# Altium schematic sheet AUAV_X05_ESC.SchDoc
size A1
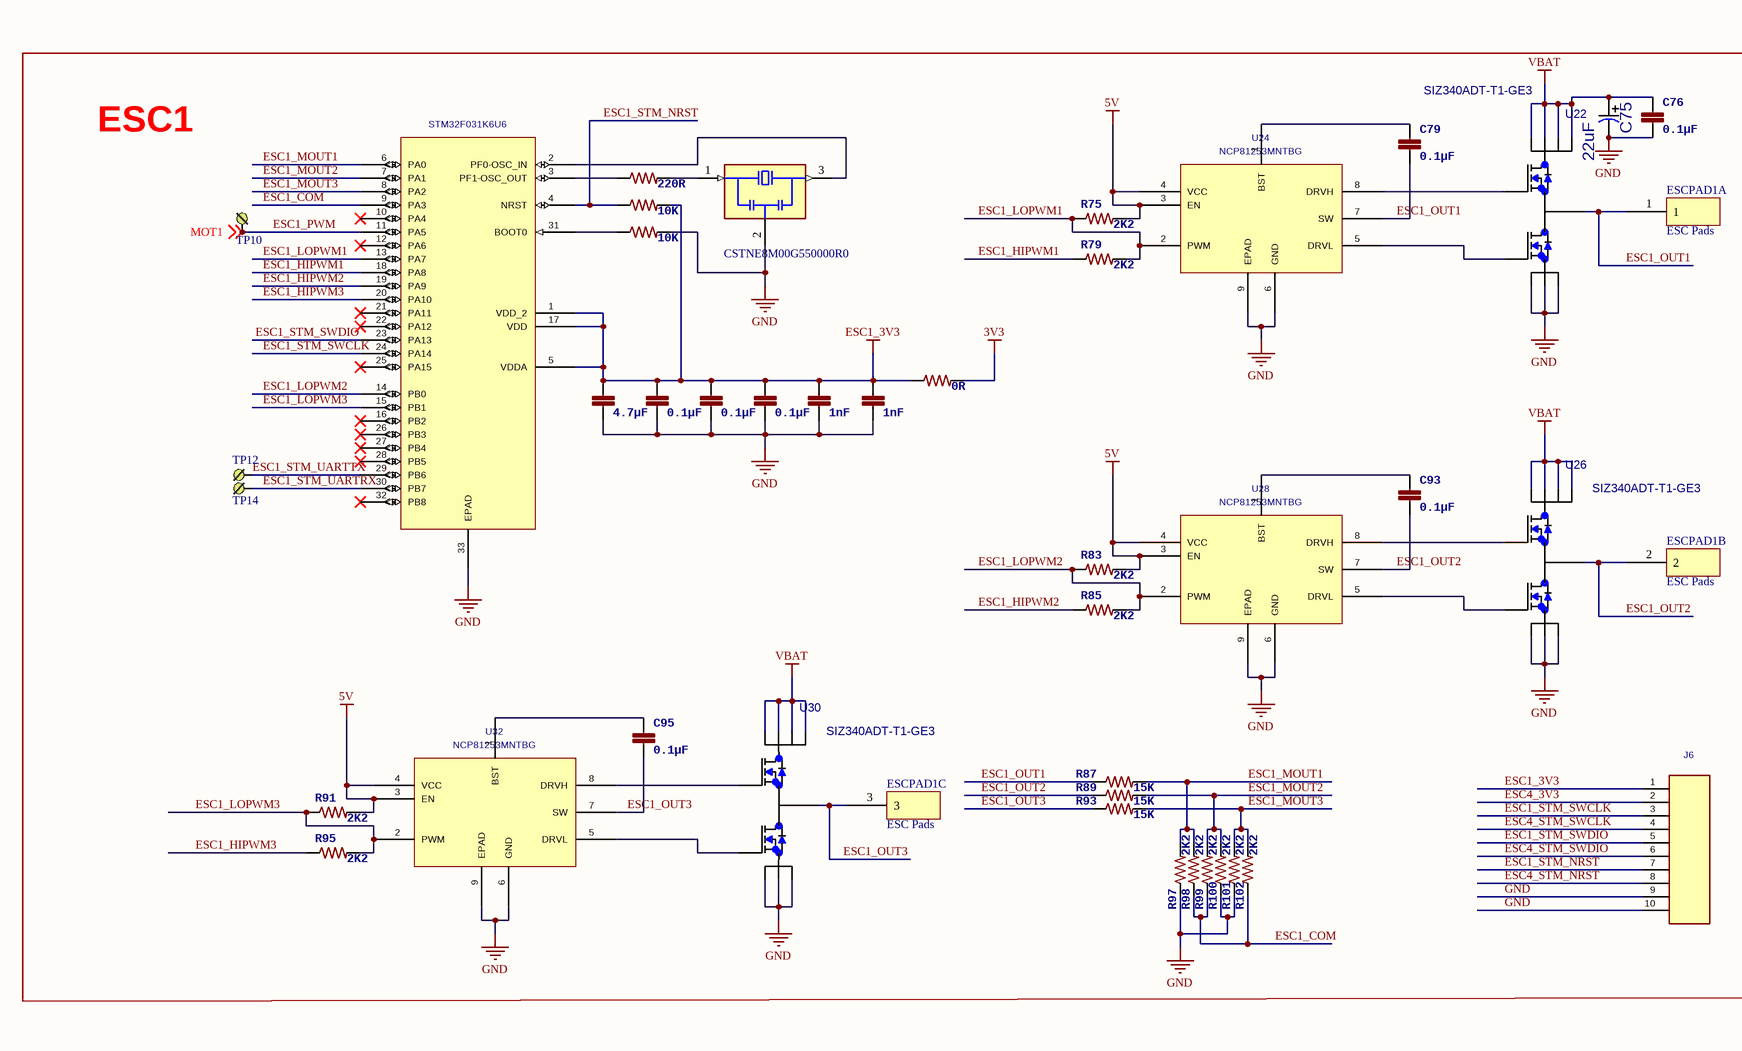
[diagram p0: AUAV_X05_ESC.SchDoc, top left]
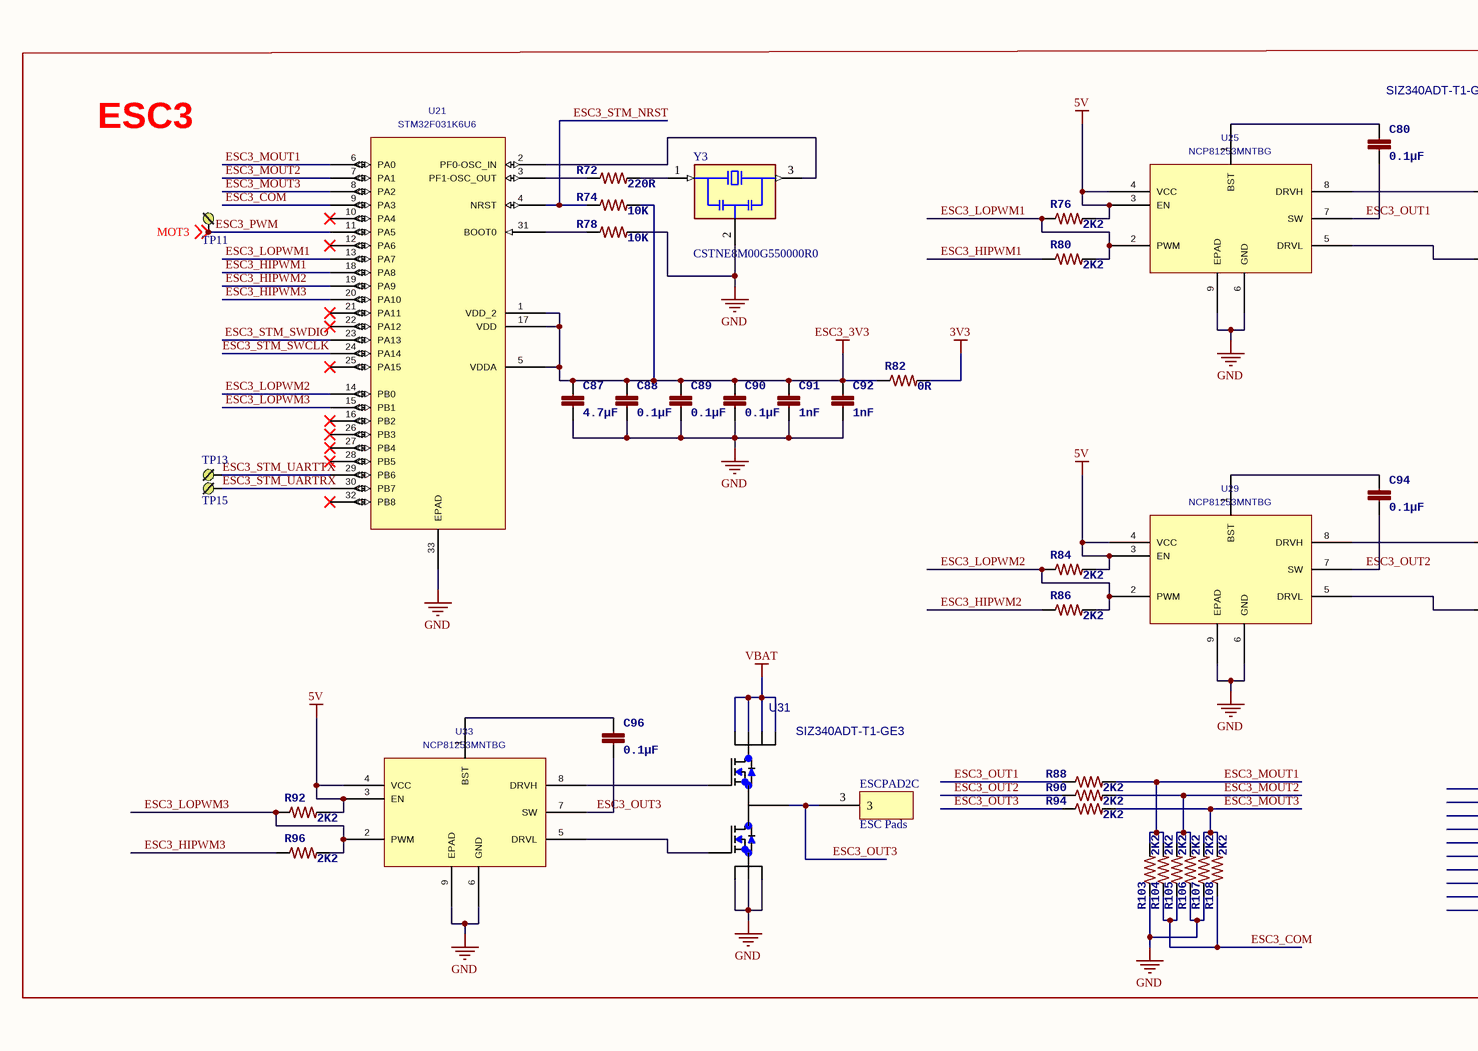
[diagram p1: AUAV_X05_ESC.SchDoc, top middle]
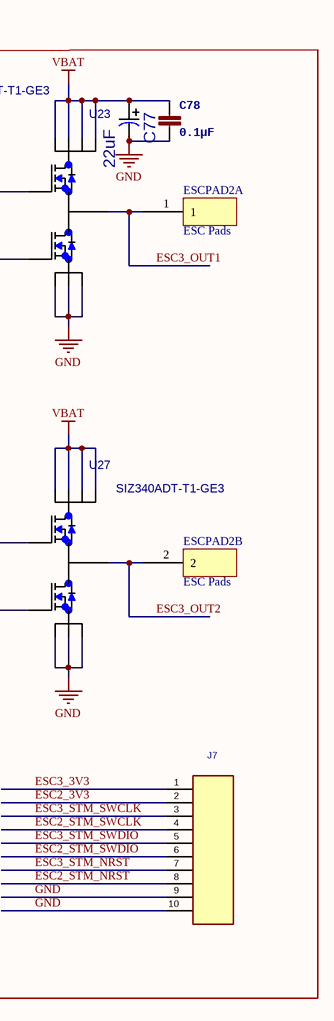
[diagram p2: AUAV_X05_ESC.SchDoc, top right]
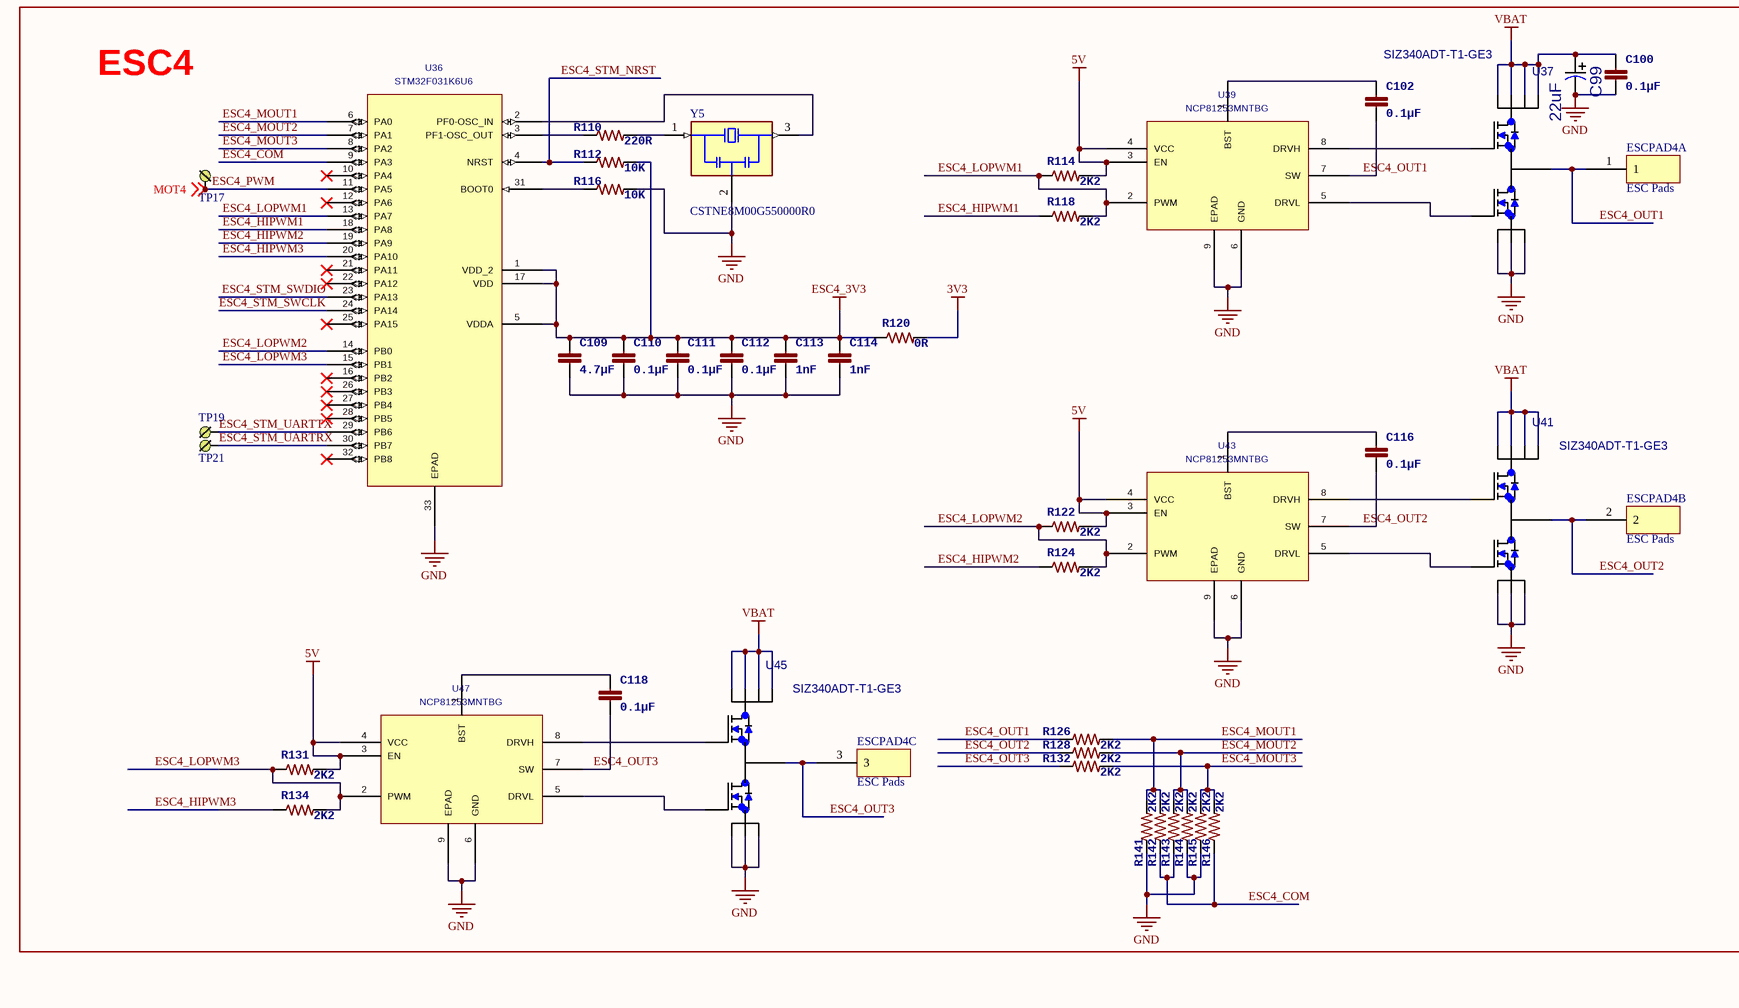
[diagram p3: AUAV_X05_ESC.SchDoc, bottom left]
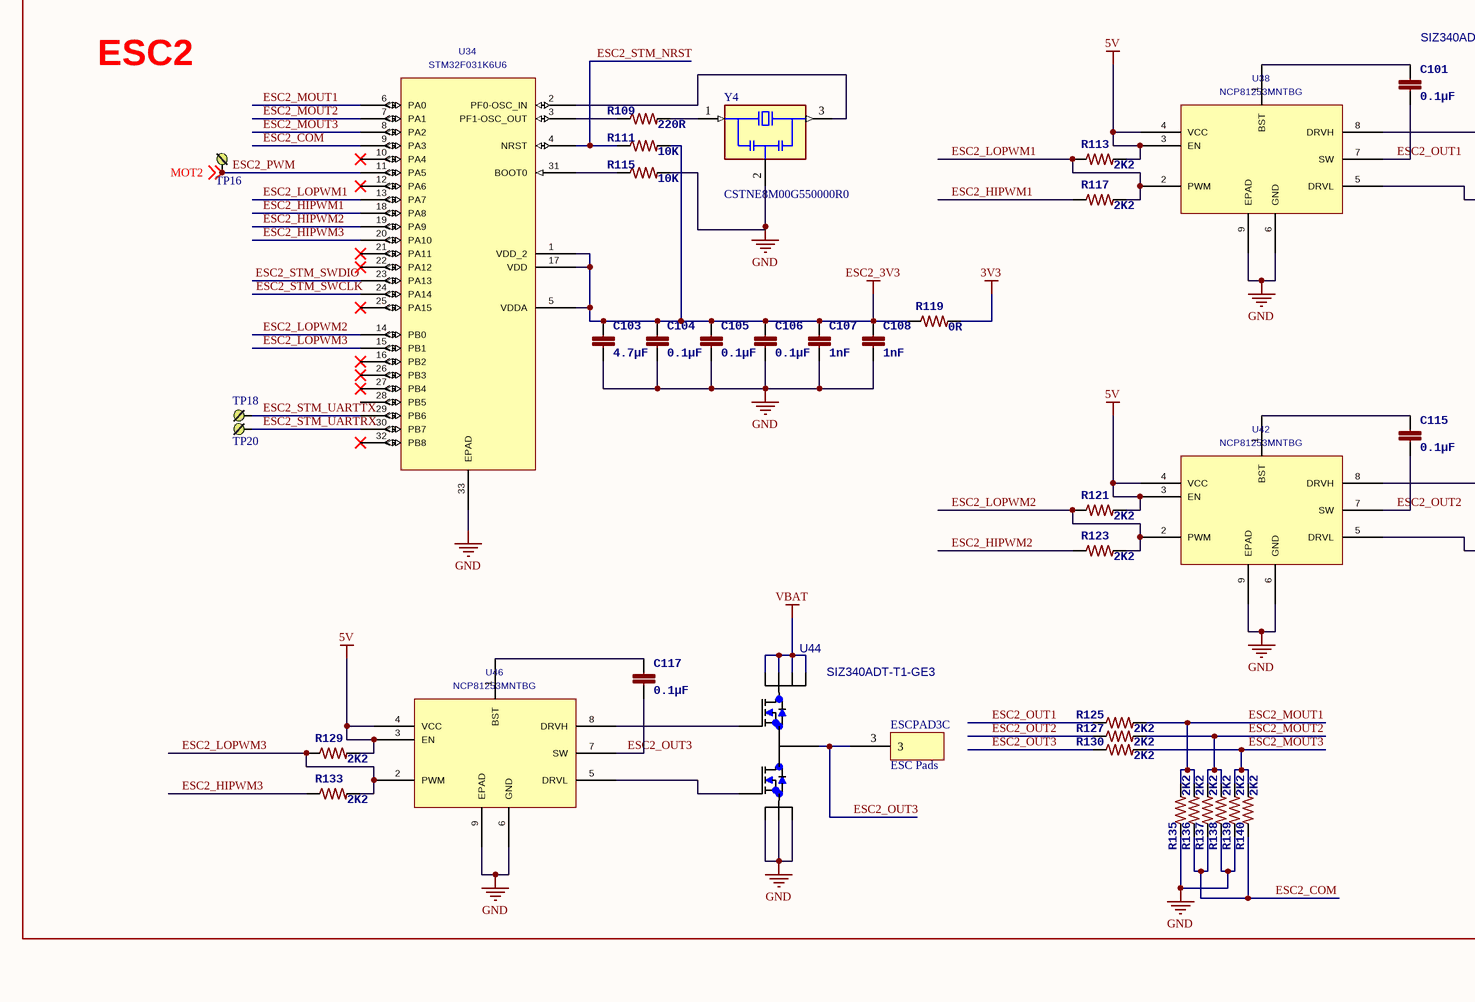
[diagram p4: AUAV_X05_ESC.SchDoc, bottom middle]
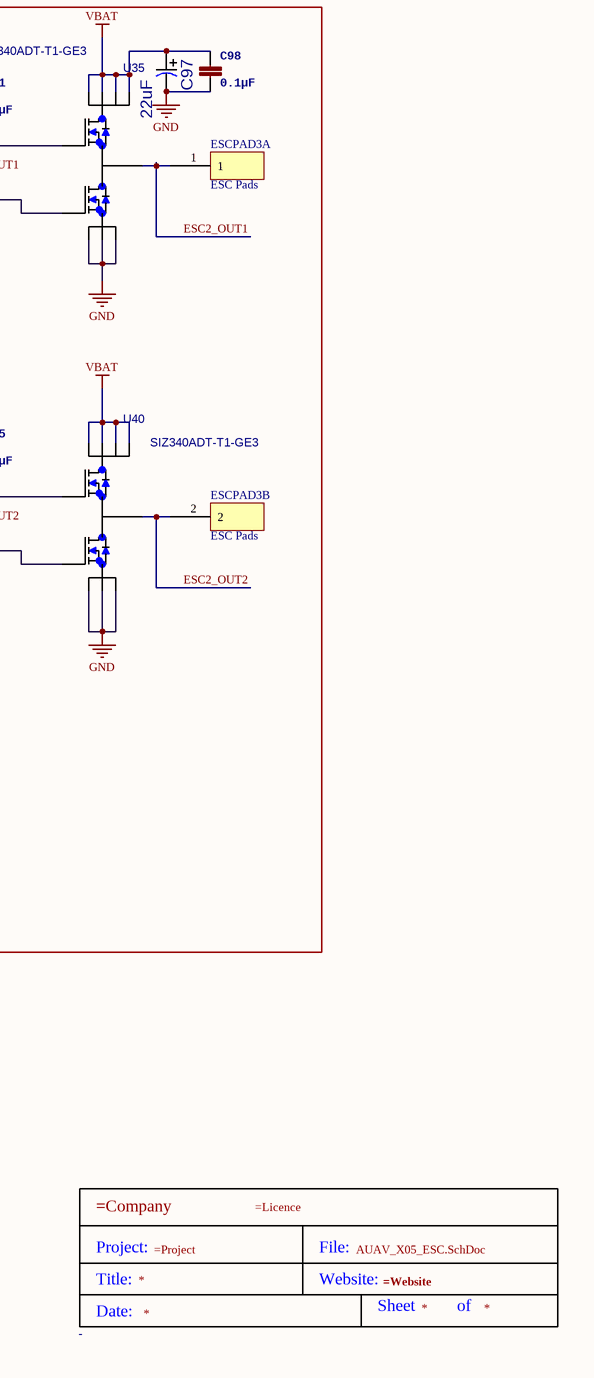
[diagram p5: AUAV_X05_ESC.SchDoc, bottom right]

## Parts
*?  Title Block  (value not drawn)
C75  value 22uF  [CAPMP3.4X1.6_1.8]  (hidden comment: CAP TANT 1206)
C76  0.1µF  [0402-CAP]
C77  value 22uF  [CAPMP3.4X1.6_1.8]  (hidden comment: CAP TANT 1206)
C78  0.1µF  [0402-CAP]
C79  0.1µF  [0402-CAP]
C80  0.1µF  [0402-CAP]
C81  4.7µF  [0603-CAP]
C82  0.1µF  [0402-CAP]
C83  0.1µF  [0402-CAP]
C84  0.1µF  [0402-CAP]
C85  1nF  [0402-CAP]
C86  1nF  [0402-CAP]
C87  4.7µF  [0603-CAP]
C88  0.1µF  [0402-CAP]
C89  0.1µF  [0402-CAP]
C90  0.1µF  [0402-CAP]
C91  1nF  [0402-CAP]
C92  1nF  [0402-CAP]
C93  0.1µF  [0402-CAP]
C94  0.1µF  [0402-CAP]
C95  0.1µF  [0402-CAP]
C96  0.1µF  [0402-CAP]
C97  value 22uF  [CAPMP3.4X1.6_1.8]  (hidden comment: CAP TANT 1206)
C98  0.1µF  [0402-CAP]
C99  value 22uF  [CAPMP3.4X1.6_1.8]  (hidden comment: CAP TANT 1206)
C100  0.1µF  [0402-CAP]
C101  0.1µF  [0402-CAP]
C102  0.1µF  [0402-CAP]
C103  4.7µF  [0603-CAP]
C104  0.1µF  [0402-CAP]
C105  0.1µF  [0402-CAP]
C106  0.1µF  [0402-CAP]
C107  1nF  [0402-CAP]
C108  1nF  [0402-CAP]
C109  4.7µF  [0603-CAP]
C110  0.1µF  [0402-CAP]
C111  0.1µF  [0402-CAP]
C112  0.1µF  [0402-CAP]
C113  1nF  [0402-CAP]
C114  1nF  [0402-CAP]
C115  0.1µF  [0402-CAP]
C116  0.1µF  [0402-CAP]
C117  0.1µF  [0402-CAP]
C118  0.1µF  [0402-CAP]
ESCPAD1  ESC Pads  [ESCPADS]  (parts A,B,C of 3)
ESCPAD2  ESC Pads  [ESCPADS]  (parts A,B,C of 3)
ESCPAD3  ESC Pads  [ESCPADS]  (parts A,B,C of 3)
ESCPAD4  ESC Pads  [ESCPADS]  (parts A,B,C of 3)
J6  20021121-00010C4  [CONN_00010C4LF_A]  (value not drawn)
J7  20021121-00010C4  [CONN_00010C4LF_A]  (value not drawn)
R71  220R  [0402-RES]
R72  220R  [0402-RES]
R73  10K  [0402-RES]
R74  10K  [0402-RES]
R75  2K2  [0402-RES]
R76  2K2  [0402-RES]
R77  10K  [0402-RES]
R78  10K  [0402-RES]
R79  2K2  [0402-RES]
R80  2K2  [0402-RES]
R81  0R  [0402-RES]
R82  0R  [0402-RES]
R83  2K2  [0402-RES]
R84  2K2  [0402-RES]
R85  2K2  [0402-RES]
R86  2K2  [0402-RES]
R87  15K  [0402-RES]
R88  2K2  [0402-RES]
R89  15K  [0402-RES]
R90  2K2  [0402-RES]
R91  2K2  [0402-RES]
R92  2K2  [0402-RES]
R93  15K  [0402-RES]
R94  2K2  [0402-RES]
R95  2K2  [0402-RES]
R96  2K2  [0402-RES]
R97  2K2  [0402-RES]
R98  2K2  [0402-RES]
R99  2K2  [0402-RES]
R100  2K2  [0402-RES]
R101  2K2  [0402-RES]
R102  2K2  [0402-RES]
R103  2K2  [0402-RES]
R104  2K2  [0402-RES]
R105  2K2  [0402-RES]
R106  2K2  [0402-RES]
R107  2K2  [0402-RES]
R108  2K2  [0402-RES]
R109  220R  [0402-RES]
R110  220R  [0402-RES]
R111  10K  [0402-RES]
R112  10K  [0402-RES]
R113  2K2  [0402-RES]
R114  2K2  [0402-RES]
R115  10K  [0402-RES]
R116  10K  [0402-RES]
R117  2K2  [0402-RES]
R118  2K2  [0402-RES]
R119  0R  [0402-RES]
R120  0R  [0402-RES]
R121  2K2  [0402-RES]
R122  2K2  [0402-RES]
R123  2K2  [0402-RES]
R124  2K2  [0402-RES]
R125  2K2  [0402-RES]
R126  2K2  [0402-RES]
R127  2K2  [0402-RES]
R128  2K2  [0402-RES]
R129  2K2  [0402-RES]
R130  2K2  [0402-RES]
R131  2K2  [0402-RES]
R132  2K2  [0402-RES]
R133  2K2  [0402-RES]
R134  2K2  [0402-RES]
R135  2K2  [0402-RES]
R136  2K2  [0402-RES]
R137  2K2  [0402-RES]
R138  2K2  [0402-RES]
R139  2K2  [0402-RES]
R140  2K2  [0402-RES]
R141  2K2  [0402-RES]
R142  2K2  [0402-RES]
R143  2K2  [0402-RES]
R144  2K2  [0402-RES]
R145  2K2  [0402-RES]
R146  2K2  [0402-RES]
TP10  TP  [SMT_PAD]  (value not drawn)
TP11  TP  [SMT_PAD]  (value not drawn)
TP12  TP  [SMT_PAD]  (value not drawn)
TP13  TP  [SMT_PAD]  (value not drawn)
TP14  TP  [SMT_PAD]  (value not drawn)
TP15  TP  [SMT_PAD]  (value not drawn)
TP16  TP  [SMT_PAD]  (value not drawn)
TP17  TP  [SMT_PAD]  (value not drawn)
TP18  TP  [SMT_PAD]  (value not drawn)
TP19  TP  [SMT_PAD]  (value not drawn)
TP20  TP  [SMT_PAD]  (value not drawn)
TP21  TP  [SMT_PAD]  (value not drawn)
U20  STM32F031K6U6  [UFQFPN32-5X5MM]
U21  STM32F031K6U6  [UFQFPN32-5X5MM]
U22  SIZ340ADT-T1-GE3  [MOSFET_DT-T1-GE3]
U23  SIZ340ADT-T1-GE3  [MOSFET_DT-T1-GE3]
U24  NCP81253MNTBG  [DFN8_2X2_ONS-L]
U25  NCP81253MNTBG  [DFN8_2X2_ONS-L]
U26  SIZ340ADT-T1-GE3  [MOSFET_DT-T1-GE3]
U27  SIZ340ADT-T1-GE3  [MOSFET_DT-T1-GE3]
U28  NCP81253MNTBG  [DFN8_2X2_ONS-L]
U29  NCP81253MNTBG  [DFN8_2X2_ONS-L]
U30  SIZ340ADT-T1-GE3  [MOSFET_DT-T1-GE3]
U31  SIZ340ADT-T1-GE3  [MOSFET_DT-T1-GE3]
U32  NCP81253MNTBG  [DFN8_2X2_ONS-L]
U33  NCP81253MNTBG  [DFN8_2X2_ONS-L]
U34  STM32F031K6U6  [UFQFPN32-5X5MM]
U35  SIZ340ADT-T1-GE3  [MOSFET_DT-T1-GE3]
U36  STM32F031K6U6  [UFQFPN32-5X5MM]
U37  SIZ340ADT-T1-GE3  [MOSFET_DT-T1-GE3]
U38  NCP81253MNTBG  [DFN8_2X2_ONS-L]
U39  NCP81253MNTBG  [DFN8_2X2_ONS-L]
U40  SIZ340ADT-T1-GE3  [MOSFET_DT-T1-GE3]
U41  SIZ340ADT-T1-GE3  [MOSFET_DT-T1-GE3]
U42  NCP81253MNTBG  [DFN8_2X2_ONS-L]
U43  NCP81253MNTBG  [DFN8_2X2_ONS-L]
U44  SIZ340ADT-T1-GE3  [MOSFET_DT-T1-GE3]
U45  SIZ340ADT-T1-GE3  [MOSFET_DT-T1-GE3]
U46  NCP81253MNTBG  [DFN8_2X2_ONS-L]
U47  NCP81253MNTBG  [DFN8_2X2_ONS-L]
Y2  CSTNE8M00G550000R0  [OSC_CSTNE8M00G550000R0]
Y3  CSTNE8M00G550000R0  [OSC_CSTNE8M00G550000R0]
Y4  CSTNE8M00G550000R0  [OSC_CSTNE8M00G550000R0]
Y5  CSTNE8M00G550000R0  [OSC_CSTNE8M00G550000R0]

## Blocks framed on the sheet
ESC3: C77 C78 C80 C87-C92 C94 C96 ESCPAD2 J7 R72 R74 R76 R78 R80 R82 R84 R86 R88 R90 R92 R94 R96 R103-R108 TP11 TP13 TP15 U21 U23 U25 U27 U29 U31 U33 Y3
ESC1: C75 C76 C79 C81-C86 C93 C95 ESCPAD1 J6 R71 R73 R75 R77 R79 R81 R83 R85 R87 R89 R91 R93 R95 R97-R102 TP10 TP12 TP14 U20 U22 U24 U26 U28 U30 U32 Y2
ESC4: C99 C100 C102 C109-C114 C116 C118 ESCPAD4 R110 R112 R114 R116 R118 R120 R122 R124 R126 R128 R131 R132 R134 R141-R146 TP17 TP19 TP21 U36 U37 U39 U41 U43 U45 U47 Y5
ESC2: C97 C98 C101 C103-C108 C115 C117 ESCPAD3 R109 R111 R113 R115 R117 R119 R121 R123 R125 R127 R129 R130 R133 R135-R140 TP16 TP18 TP20 U34 U35 U38 U40 U42 U44 U46 Y4

## Nets
3V3: R81.P$2 R82.P$2 R119.P$2 R120.P$2
5V: R75.P$2 R76.P$2 R83.P$2 R84.P$2 R91.P$2 R92.P$2 R113.P$2 R114.P$2 R121.P$2 R122.P$2 R129.P$2 R131.P$2 U24.3(EN) U24.4(VCC) U25.3(EN) U25.4(VCC) U28.3(EN) U28.4(VCC) U29.3(EN) U29.4(VCC) U32.3(EN) U32.4(VCC) U33.3(EN) U33.4(VCC) U38.3(EN) U38.4(VCC) U39.3(EN) U39.4(VCC) U42.3(EN) U42.4(VCC) U43.3(EN) U43.4(VCC) U46.3(EN) U46.4(VCC) U47.3(EN) U47.4(VCC)
ESC1_3V3: C81.P$1 C82.P$1 C83.P$1 C84.P$1 C85.P$1 C86.P$1 J6.1 R73.P$2 R81.P$1 U20.1(VDD_2) U20.5(VDDA) U20.17(VDD)
ESC2_3V3: C103.P$1 C104.P$1 C105.P$1 C106.P$1 C107.P$1 C108.P$1 J7.2 R111.P$2 R119.P$1 U34.1(VDD_2) U34.5(VDDA) U34.17(VDD)
ESC3_3V3: C87.P$1 C88.P$1 C89.P$1 C90.P$1 C91.P$1 C92.P$1 J7.1 R74.P$2 R82.P$1 U21.1(VDD_2) U21.5(VDDA) U21.17(VDD)
ESC4_3V3: C109.P$1 C110.P$1 C111.P$1 C112.P$1 C113.P$1 C114.P$1 J6.2 R112.P$2 R120.P$1 U36.1(VDD_2) U36.5(VDDA) U36.17(VDD)
GND: C75.2 C76.P$2 C77.2 C78.P$2 C81.P$2 C82.P$2 C83.P$2 C84.P$2 C85.P$2 C86.P$2 C87.P$2 C88.P$2 C89.P$2 C90.P$2 C91.P$2 C92.P$2 C97.2 C98.P$2 C99.2 C100.P$2 C103.P$2 C104.P$2 C105.P$2 C106.P$2 C107.P$2 C108.P$2 C109.P$2 C110.P$2 C111.P$2 C112.P$2 C113.P$2 C114.P$2 J6.9 J6.10 J7.9 J7.10 R77.P$2 R78.P$2 R97.P$1 R100.P$1 R101.P$1 R103.P$1 R106.P$1 R107.P$1 R115.P$2 R116.P$2 R135.P$1 R138.P$1 R139.P$1 R141.P$1 R144.P$1 R145.P$1 U20.33(EPAD) U21.33(EPAD) U22.5(S2_2) U22.6(S2_3) U22.7(S2) U23.5(S2_2) U23.6(S2_3) U23.7(S2) U24.6(GND) U24.9(EPAD) U25.6(GND) U25.9(EPAD) U26.5(S2_2) U26.6(S2_3) U26.7(S2) U27.5(S2_2) U27.6(S2_3) U27.7(S2) U28.6(GND) U28.9(EPAD) U29.6(GND) U29.9(EPAD) U30.5(S2_2) U30.6(S2_3) U30.7(S2) U31.5(S2_2) U31.6(S2_3) U31.7(S2) U32.6(GND) U32.9(EPAD) U33.6(GND) U33.9(EPAD) U34.33(EPAD) U35.5(S2_2) U35.6(S2_3) U35.7(S2) U36.33(EPAD) U37.5(S2_2) U37.6(S2_3) U37.7(S2) U38.6(GND) U38.9(EPAD) U39.6(GND) U39.9(EPAD) U40.5(S2_2) U40.6(S2_3) U40.7(S2) U41.5(S2_2) U41.6(S2_3) U41.7(S2) U42.6(GND) U42.9(EPAD) U43.6(GND) U43.9(EPAD) U44.5(S2_2) U44.6(S2_3) U44.7(S2) U45.5(S2_2) U45.6(S2_3) U45.7(S2) U46.6(GND) U46.9(EPAD) U47.6(GND) U47.9(EPAD) Y2.2(GND) Y3.2(GND) Y4.2(GND) Y5.2(GND)
VBAT: C75.1 C76.P$1 C77.1 C78.P$1 C97.1 C98.P$1 C99.1 C100.P$1 U22.2(D1_2) U22.3(D1_3) U22.4(D1_4) U22.10(D1) U23.2(D1_2) U23.3(D1_3) U23.4(D1_4) U23.10(D1) U26.2(D1_2) U26.3(D1_3) U26.4(D1_4) U26.10(D1) U27.2(D1_2) U27.3(D1_3) U27.4(D1_4) U27.10(D1) U30.2(D1_2) U30.3(D1_3) U30.4(D1_4) U30.10(D1) U31.2(D1_2) U31.3(D1_3) U31.4(D1_4) U31.10(D1) U35.2(D1_2) U35.3(D1_3) U35.4(D1_4) U35.10(D1) U37.2(D1_2) U37.3(D1_3) U37.4(D1_4) U37.10(D1) U40.2(D1_2) U40.3(D1_3) U40.4(D1_4) U40.10(D1) U41.2(D1_2) U41.3(D1_3) U41.4(D1_4) U41.10(D1) U44.2(D1_2) U44.3(D1_3) U44.4(D1_4) U44.10(D1) U45.2(D1_2) U45.3(D1_3) U45.4(D1_4) U45.10(D1)
ESC1_COM: R98.P$1 R99.P$1 R102.P$1 U20.9(PA3)
ESC1_HIPWM1: R79.P$1 U20.18(PA8)
ESC1_HIPWM2: R85.P$1 U20.19(PA9)
ESC1_HIPWM3: R95.P$1 U20.20(PA10)
ESC1_LOPWM1: R75.P$1 R79.P$2 U20.13(PA7) U24.2(PWM)
ESC1_LOPWM2: R83.P$1 R85.P$2 U20.14(PB0) U28.2(PWM)
ESC1_LOPWM3: R91.P$1 R95.P$2 U20.15(PB1) U32.2(PWM)
ESC1_MOUT1: R87.P$2 R97.P$2 R98.P$2 U20.6(PA0)
ESC1_MOUT2: R89.P$2 R99.P$2 R100.P$2 U20.7(PA1)
ESC1_MOUT3: R93.P$2 R101.P$2 R102.P$2 U20.8(PA2)
ESC1_OUT1: C79.P$2 ESCPAD1.1 R87.P$1 U22.9(S1/D2) U24.7(SW)
ESC1_OUT2: C93.P$2 ESCPAD1.2 R89.P$1 U26.9(S1/D2) U28.7(SW)
ESC1_OUT3: C95.P$2 ESCPAD1.3 R93.P$1 U30.9(S1/D2) U32.7(SW)
ESC1_PWM: TP10.1 U20.11(PA5) ; off-sheet MOT1  [also labelled MOT1]
ESC1_STM_NRST: J6.7 R73.P$1 U20.4(NRST)
ESC1_STM_SWCLK: J6.3 U20.24(PA14)
ESC1_STM_SWDIO: J6.5 U20.23(PA13)
ESC1_STM_UARTRX: TP14.1 U20.30(PB7)
ESC1_STM_UARTTX: TP12.1 U20.29(PB6)
ESC2_COM: R136.P$1 R137.P$1 R140.P$1 U34.9(PA3)
ESC2_HIPWM1: R117.P$1 U34.18(PA8)
ESC2_HIPWM2: R123.P$1 U34.19(PA9)
ESC2_HIPWM3: R133.P$1 U34.20(PA10)
ESC2_LOPWM1: R113.P$1 R117.P$2 U34.13(PA7) U38.2(PWM)
ESC2_LOPWM2: R121.P$1 R123.P$2 U34.14(PB0) U42.2(PWM)
ESC2_LOPWM3: R129.P$1 R133.P$2 U34.15(PB1) U46.2(PWM)
ESC2_MOUT1: R125.P$2 R135.P$2 R136.P$2 U34.6(PA0)
ESC2_MOUT2: R127.P$2 R137.P$2 R138.P$2 U34.7(PA1)
ESC2_MOUT3: R130.P$2 R139.P$2 R140.P$2 U34.8(PA2)
ESC2_OUT1: C101.P$2 ESCPAD3.1 R125.P$1 U35.9(S1/D2) U38.7(SW)
ESC2_OUT2: C115.P$2 ESCPAD3.2 R127.P$1 U40.9(S1/D2) U42.7(SW)
ESC2_OUT3: C117.P$2 ESCPAD3.3 R130.P$1 U44.9(S1/D2) U46.7(SW)
ESC2_PWM: TP16.1 U34.11(PA5) ; off-sheet MOT2  [also labelled MOT2]
ESC2_STM_NRST: J7.8 R111.P$1 U34.4(NRST)
ESC2_STM_SWCLK: J7.4 U34.24(PA14)
ESC2_STM_SWDIO: J7.6 U34.23(PA13)
ESC2_STM_UARTRX: TP20.1 U34.30(PB7)
ESC2_STM_UARTTX: TP18.1 U34.29(PB6)
ESC3_COM: R104.P$1 R105.P$1 R108.P$1 U21.9(PA3)
ESC3_HIPWM1: R80.P$1 U21.18(PA8)
ESC3_HIPWM2: R86.P$1 U21.19(PA9)
ESC3_HIPWM3: R96.P$1 U21.20(PA10)
ESC3_LOPWM1: R76.P$1 R80.P$2 U21.13(PA7) U25.2(PWM)
ESC3_LOPWM2: R84.P$1 R86.P$2 U21.14(PB0) U29.2(PWM)
ESC3_LOPWM3: R92.P$1 R96.P$2 U21.15(PB1) U33.2(PWM)
ESC3_MOUT1: R88.P$2 R103.P$2 R104.P$2 U21.6(PA0)
ESC3_MOUT2: R90.P$2 R105.P$2 R106.P$2 U21.7(PA1)
ESC3_MOUT3: R94.P$2 R107.P$2 R108.P$2 U21.8(PA2)
ESC3_OUT1: C80.P$2 ESCPAD2.1 R88.P$1 U23.9(S1/D2) U25.7(SW)
ESC3_OUT2: C94.P$2 ESCPAD2.2 R90.P$1 U27.9(S1/D2) U29.7(SW)
ESC3_OUT3: C96.P$2 ESCPAD2.3 R94.P$1 U31.9(S1/D2) U33.7(SW)
ESC3_PWM: TP11.1 U21.11(PA5) ; off-sheet MOT3  [also labelled MOT3]
ESC3_STM_NRST: J7.7 R74.P$1 U21.4(NRST)
ESC3_STM_SWCLK: J7.3 U21.24(PA14)
ESC3_STM_SWDIO: J7.5 U21.23(PA13)
ESC3_STM_UARTRX: TP15.1 U21.30(PB7)
ESC3_STM_UARTTX: TP13.1 U21.29(PB6)
ESC4_COM: R142.P$1 R143.P$1 R146.P$1 U36.9(PA3)
ESC4_HIPWM1: R118.P$1 U36.18(PA8)
ESC4_HIPWM2: R124.P$1 U36.19(PA9)
ESC4_HIPWM3: R134.P$1 U36.20(PA10)
ESC4_LOPWM1: R114.P$1 R118.P$2 U36.13(PA7) U39.2(PWM)
ESC4_LOPWM2: R122.P$1 R124.P$2 U36.14(PB0) U43.2(PWM)
ESC4_LOPWM3: R131.P$1 R134.P$2 U36.15(PB1) U47.2(PWM)
ESC4_MOUT1: R126.P$2 R141.P$2 R142.P$2 U36.6(PA0)
ESC4_MOUT2: R128.P$2 R143.P$2 R144.P$2 U36.7(PA1)
ESC4_MOUT3: R132.P$2 R145.P$2 R146.P$2 U36.8(PA2)
ESC4_OUT1: C102.P$2 ESCPAD4.1 R126.P$1 U37.9(S1/D2) U39.7(SW)
ESC4_OUT2: C116.P$2 ESCPAD4.2 R128.P$1 U41.9(S1/D2) U43.7(SW)
ESC4_OUT3: C118.P$2 ESCPAD4.3 R132.P$1 U45.9(S1/D2) U47.7(SW)
ESC4_PWM: TP17.1 U36.11(PA5) ; off-sheet MOT4  [also labelled MOT4]
ESC4_STM_NRST: J6.8 R112.P$1 U36.4(NRST)
ESC4_STM_SWCLK: J6.4 U36.24(PA14)
ESC4_STM_SWDIO: J6.6 U36.23(PA13)
ESC4_STM_UARTRX: TP21.1 U36.30(PB7)
ESC4_STM_UARTTX: TP19.1 U36.29(PB6)
NetC79_P$1: C79.P$1 U24.1(BST)
NetC80_P$1: C80.P$1 U25.1(BST)
NetC93_P$1: C93.P$1 U28.1(BST)
NetC94_P$1: C94.P$1 U29.1(BST)
NetC95_P$1: C95.P$1 U32.1(BST)
NetC96_P$1: C96.P$1 U33.1(BST)
NetC101_P$1: C101.P$1 U38.1(BST)
NetC102_P$1: C102.P$1 U39.1(BST)
NetC115_P$1: C115.P$1 U42.1(BST)
NetC116_P$1: C116.P$1 U43.1(BST)
NetC117_P$1: C117.P$1 U46.1(BST)
NetC118_P$1: C118.P$1 U47.1(BST)
NetR71_P$1: R71.P$1 U20.3(PF1-OSC_OUT)
NetR71_P$2: R71.P$2 Y2.1(IN)
NetR72_P$1: R72.P$1 U21.3(PF1-OSC_OUT)
NetR72_P$2: R72.P$2 Y3.1(IN)
NetR77_P$1: R77.P$1 U20.31(BOOT0)
NetR78_P$1: R78.P$1 U21.31(BOOT0)
NetR109_P$1: R109.P$1 U34.3(PF1-OSC_OUT)
NetR109_P$2: R109.P$2 Y4.1(IN)
NetR110_P$1: R110.P$1 U36.3(PF1-OSC_OUT)
NetR110_P$2: R110.P$2 Y5.1(IN)
NetR115_P$1: R115.P$1 U34.31(BOOT0)
NetR116_P$1: R116.P$1 U36.31(BOOT0)
NetU20_2: U20.2(PF0-OSC_IN) Y2.3(OUT)
NetU21_2: U21.2(PF0-OSC_IN) Y3.3(OUT)
NetU22_1: U22.1(G1) U24.8(DRVH)
NetU22_8: U22.8(G2) U24.5(DRVL)
NetU23_1: U23.1(G1) U25.8(DRVH)
NetU23_8: U23.8(G2) U25.5(DRVL)
NetU26_1: U26.1(G1) U28.8(DRVH)
NetU26_8: U26.8(G2) U28.5(DRVL)
NetU27_1: U27.1(G1) U29.8(DRVH)
NetU27_8: U27.8(G2) U29.5(DRVL)
NetU30_1: U30.1(G1) U32.8(DRVH)
NetU30_8: U30.8(G2) U32.5(DRVL)
NetU31_1: U31.1(G1) U33.8(DRVH)
NetU31_8: U31.8(G2) U33.5(DRVL)
NetU34_2: U34.2(PF0-OSC_IN) Y4.3(OUT)
NetU35_1: U35.1(G1) U38.8(DRVH)
NetU35_8: U35.8(G2) U38.5(DRVL)
NetU36_2: U36.2(PF0-OSC_IN) Y5.3(OUT)
NetU37_1: U37.1(G1) U39.8(DRVH)
NetU37_8: U37.8(G2) U39.5(DRVL)
NetU40_1: U40.1(G1) U42.8(DRVH)
NetU40_8: U40.8(G2) U42.5(DRVL)
NetU41_1: U41.1(G1) U43.8(DRVH)
NetU41_8: U41.8(G2) U43.5(DRVL)
NetU44_1: U44.1(G1) U46.8(DRVH)
NetU44_8: U44.8(G2) U46.5(DRVL)
NetU45_1: U45.1(G1) U47.8(DRVH)
NetU45_8: U45.8(G2) U47.5(DRVL)

Not connected (* = marked no-connect by the designer): U20 10(PA4)* 12(PA6)* 16(PB2)* 21(PA11)* 22(PA12)* 25(PA15)* 26(PB3)* 27(PB4)* 28(PB5)* 32(PB8)*; U21 10(PA4)* 12(PA6)* 16(PB2)* 21(PA11)* 22(PA12)* 25(PA15)* 26(PB3)* 27(PB4)* 28(PB5)* 32(PB8)*; U34 10(PA4)* 12(PA6)* 16(PB2)* 21(PA11)* 22(PA12)* 25(PA15)* 26(PB3)* 27(PB4)* 28(PB5) 32(PB8)*; U36 10(PA4)* 12(PA6)* 16(PB2)* 21(PA11)* 22(PA12)* 25(PA15)* 26(PB3)* 27(PB4)* 28(PB5)* 32(PB8)*

## Notes on the sheet
- (in symbol Title Block) Project:; File:; Title:; Website:; Sheet; of; Date:

## Library data of the parts
C75 C77 C97 C99 = CAP TANT 1206: Mfr_Name: Kemet; Manufacturer_Part_Number: T491A106K010AT; Copyright: Copyright (C) 2022 Ultra Librarian. All rights reserved.; Digi-Key_Part_Number_1: 399-3684-1-ND; Digi-Key_Part_Number_2: 399-3684-2-ND; Digi-Key_Part_Number_3: 399-3684-6-ND
C76 C78-C80 C82-C86 C88-C96 C98 C100-C102 C104-C108 C110-C118 = CAP0402: CAP CER 8PF 50V C0G 0402; PARTNO: C1005C0G1H080C; 3DR_PARTNO: ECM0710; Value: 8p; Supplier 1: Digi-Key; Supplier Part Number 1: 445-4890-1-ND
C81 C87 C103 C109 = CAP0603: CAP CER 2.2UF 16V 10% X6S 0603; PARTNO: C1608X6S1C225K080AC; 3DR_PARTNO: ECM0619; Value: 2u2; Supplier 1: Digi-Key; Supplier Part Number 1: 445-7438-1-ND
J6 J7 = 20021121-00010C4: Mfr_Name: Amphenol ICC; Manufacturer_Part_Number: 20021121-00010C4LF; Value: 20021121-00010C4; Copyright: Copyright (C) 2022 Ultra Librarian. All rights reserved.; Digi-Key_Part_Number_1: 609-3695-1-ND; Digi-Key_Part_Number_2: 609-3695-2-ND; Digi-Key_Part_Number_3: 609-3695-2-NDL; Digi-Key_Part_Number_4: 609-3695-6-ND
R71-R146 = RESISTOR0402-RES: RES 10K OHM 1/16W 1% 0402 SMD; PARTNO: RC0402FR-0710KL; 3DR_PARTNO: ECM0800; Supplier 1: Digi-Key; Value: 10K; Supplier Part Number 1: 311-10.0KLRCT-ND
U20 U21 U34 U36 = STM32F031K6U6: Mfr_Name: STMicroelectronics; C: Copyright (C) 2016 Accelerated Designs. All rights reserved; Value: STM32F031K6U6; Copyright: Copyright (C) 2022 Ultra Librarian. All rights reserved.; Manufacturer_Part_Number: STM32F031K6U6
U22 U23 U26 U27 U30 U31 U35 U37 U40 U41 U44 U45 = SIZ340ADT-T1-GE3: Mfr_Name: Vishay; C: Copyright (C) 2018 Accelerated Designs. All rights reserved; Copyright: Copyright (C) 2022 Ultra Librarian. All rights reserved.; Manufacturer_Part_Number: SIZ340ADT-T1-GE3; Digi-Key_Part_Number_1: 742-SIZ340ADT-T1-GE3TR-ND; Digi-Key_Part_Number_2: 742-SIZ340ADT-T1-GE3CT-ND; Digi-Key_Part_Number_3: 742-SIZ340ADT-T1-GE3DKR-ND; Value: SIZ340ADT-T1-GE3
U24 U25 U28 U29 U32 U33 U38 U39 U42 U43 U46 U47 = NCP81253MNTBG: Mfr_Name: Renesas Electronics; Manufacturer_Part_Number: ISL6208BCRZ-TCT-ND; Value: ISL6208BCRZ-TCT-; C: Copyright (C) 2016 Accelerated Designs. All rights reserved; Copyright: Copyright (C) 2022 Ultra Librarian. All rights reserved.; Digi-Key_Part_Number_1: ISL6208BCRZ-TCT-ND
Y2-Y5 = CSTNE8M00G550000R0: 8MHz Ceramic Resonator Built in Capacitor 33pF Â±0.2% 40 Ohms -40Â°C ~ 85Â°C Surface Mount; MF: Murata Electronics; Value: *; SnapEDA_Link: https://www.snapeda.com/parts/CSTNE8M00G550000R0/Murata%20Electronics%20North%20America/view-part/2842151/?ref=snap; MP: CSTNE8M00G550000R0; Check_prices: https://www.snapeda.com/parts/CSTNE8M00G550000R0/Murata%20Electronics%20North%20America/view-part/2842151/?ref=eda; Purchase-URL: https://pricing.snapeda.com/search/part/CSTNE8M00G550000R0/?ref=eda; Availability: Good; Price: None; Package: SMD-3 Murata
*? = Title Block: Size: -